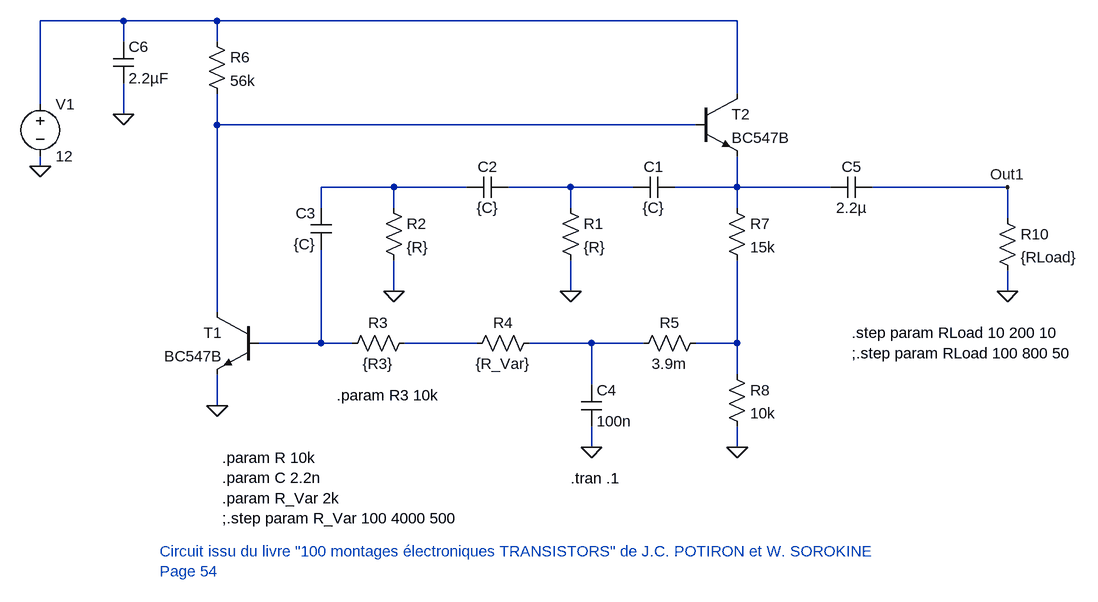
[diagram p0: schematic Oscill_BF-typeRC.asc]
Oscill_BF-typeRC.asc, the LTspice schematic file:
Version 4.1
SHEET 1 1972 924
WIRE 32 64 -96 64
WIRE 176 64 32 64
WIRE 976 64 176 64
WIRE 32 96 32 64
WIRE 176 96 176 64
WIRE 976 176 976 64
WIRE -96 192 -96 64
WIRE 32 208 32 160
WIRE 176 224 176 176
WIRE 912 224 176 224
WIRE -96 288 -96 272
WIRE 448 320 336 320
WIRE 560 320 448 320
WIRE 720 320 624 320
WIRE 816 320 720 320
WIRE 976 320 976 272
WIRE 976 320 880 320
WIRE 1120 320 976 320
WIRE 1392 320 1184 320
WIRE 336 352 336 320
WIRE 448 352 448 320
WIRE 720 352 720 320
WIRE 976 352 976 320
WIRE 1392 368 1392 320
WIRE 448 480 448 432
WIRE 720 480 720 432
WIRE 1392 480 1392 448
WIRE 176 512 176 224
WIRE 336 560 336 416
WIRE 336 560 240 560
WIRE 384 560 336 560
WIRE 576 560 464 560
WIRE 752 560 656 560
WIRE 832 560 752 560
WIRE 976 560 976 432
WIRE 976 560 912 560
WIRE 976 608 976 560
WIRE 752 624 752 560
WIRE 176 656 176 608
WIRE 752 720 752 688
WIRE 976 720 976 688
FLAG -96 288 0
FLAG 32 208 0
FLAG 176 656 0
FLAG 752 720 0
FLAG 976 720 0
FLAG 720 480 0
FLAG 448 480 0
FLAG 1392 320 Out1
FLAG 1392 480 0
SYMBOL voltage -96 176 R0
WINDOW 123 0 0 Left 0
WINDOW 39 0 0 Left 0
SYMATTR InstName V1
SYMATTR Value 12
SYMBOL npn 912 176 R0
SYMATTR InstName T2
SYMATTR Value BC547B
SYMBOL npn 240 512 M0
SYMATTR InstName T1
SYMATTR Value BC547B
SYMBOL cap 16 96 R0
SYMATTR InstName C6
SYMATTR Value 2.2µF
SYMBOL res 160 80 R0
SYMATTR InstName R6
SYMATTR Value 56k
SYMBOL res 960 336 R0
SYMATTR InstName R7
SYMATTR Value 15k
SYMBOL res 704 336 R0
SYMATTR InstName R1
SYMATTR Value {R}
SYMBOL res 432 336 R0
SYMATTR InstName R2
SYMATTR Value {R}
SYMBOL cap 880 304 R90
WINDOW 0 0 32 VBottom 2
WINDOW 3 32 32 VTop 2
SYMATTR InstName C1
SYMATTR Value {C}
SYMBOL cap 624 304 R90
WINDOW 0 0 32 VBottom 2
WINDOW 3 32 32 VTop 2
SYMATTR InstName C2
SYMATTR Value {C}
SYMBOL cap 352 416 R180
WINDOW 0 24 56 Left 2
WINDOW 3 24 8 Left 2
SYMATTR InstName C3
SYMATTR Value {C}
SYMBOL res 480 544 R90
WINDOW 0 0 56 VBottom 2
WINDOW 3 32 56 VTop 2
SYMATTR InstName R3
SYMATTR Value {R3}
SYMBOL res 672 544 R90
WINDOW 0 0 56 VBottom 2
WINDOW 3 32 56 VTop 2
SYMATTR InstName R4
SYMATTR Value {R_Var}
SYMBOL res 928 544 R90
WINDOW 0 0 56 VBottom 2
WINDOW 3 32 56 VTop 2
SYMATTR InstName R5
SYMATTR Value 3.9m
SYMBOL cap 736 624 R0
SYMATTR InstName C4
SYMATTR Value 100n
SYMBOL res 960 592 R0
SYMATTR InstName R8
SYMATTR Value 10k
SYMBOL cap 1184 304 R90
WINDOW 0 0 32 VBottom 2
WINDOW 3 32 32 VTop 2
SYMATTR InstName C5
SYMATTR Value 2.2µ
SYMBOL res 1376 352 R0
SYMATTR InstName R10
SYMATTR Value {RLoad}
TEXT 720 768 Left 2 !.tran .1
TEXT 184 736 Left 2 !.param R 10k\n.param C 2.2n\n.param R_Var 2k\n;.step param R_Var 100 4000 500
TEXT 360 640 Left 2 !.param R3 10k
TEXT 88 880 Left 2 ;Circuit issu du livre "100 montages électroniques TRANSISTORS" de J.C. POTIRON et W. SOROKINE\nPage 54
TEXT 1152 544 Left 2 !.step param RLoad 10 200 10\n;.step param RLoad 100 800 50

The netlist it stands for:
* Oscill_BF-typeRC.asc
V1 N001 0 12
Q§T2 N001 N002 N005 0 BC547B
Q§T1 N002 N006 0 0 BC547B
C6 N001 0 2.2µF
R6 N001 N002 56k
R7 N005 N009 15k
R1 N004 0 {R}
R2 N003 0 {R}
C1 N005 N004 {C}
C2 N004 N003 {C}
C3 N006 N003 {C}
R3 N007 N006 {R3}
R4 N008 N007 {R_Var}
R5 N009 N008 3.9m
C4 N008 0 100n
R8 N009 0 10k
C5 Out1 N005 2.2µ
R10 Out1 0 {RLoad}
.model NPN NPN
.model PNP PNP
.lib standard.bjt
.tran .1
.param R 10k
.param C 2.2n
.param R_Var 2k
;.step param R_Var 100 4000 500
.param R3 10k
* Circuit issu du livre "100 montages électroniques TRANSISTORS" de J.C. POTIRON et W. SOROKINE
* Page 54
.step param RLoad 10 200 10
;.step param RLoad 100 800 50
.backanno
.end